# Altium project PCB_Project1.PrjPCB
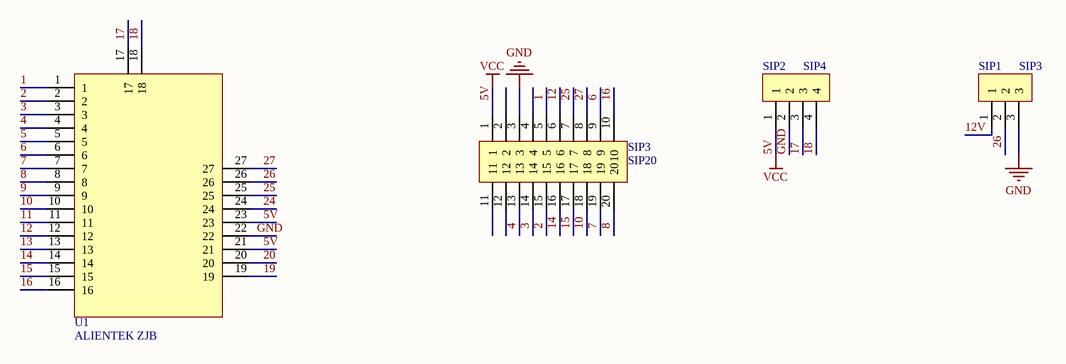
[diagram p0: Sheet1.SchDoc]
1 sheet, 4 parts. Net scope: global (net labels, ports and power ports of the same name join across sheets).
Board file: PCB1.PcbDoc

## Sheet Sheet1.SchDoc
size A4

### Parts
SIP1  SIP3  [SIP3]
SIP2  SIP4  [SIP4]
SIP3  SIP20  [SIP20]
U1  ALIENTEK ZJB  [ALIENTEK ZJB]

### Nets
5V: SIP2.1 SIP3.1 U1.21 U1.23  [also labelled VCC]
GND: SIP1.3 SIP2.2 SIP3.3 U1.22
1: SIP3.5 U1.1
2: SIP3.15 U1.2
3: SIP3.14 U1.3
4: SIP3.13 U1.4
5: U1.5
6: SIP3.9 U1.6
7: SIP3.19 U1.7
8: SIP3.20 U1.8
9: U1.9
10: SIP3.18 U1.10
11: U1.11
12: SIP3.6 U1.12
12V: SIP1.1
13: U1.13
14: SIP3.16 U1.14
15: SIP3.17 U1.15
16: SIP3.10 U1.16
17: SIP2.3 U1.17
18: SIP2.4 U1.18
19: U1.19
20: U1.20
24: U1.24
25: SIP3.7 U1.25
26: SIP1.2 U1.26
27: SIP3.8 U1.27

Not connected (* = marked no-connect by the designer): SIP3 2 4 11 12